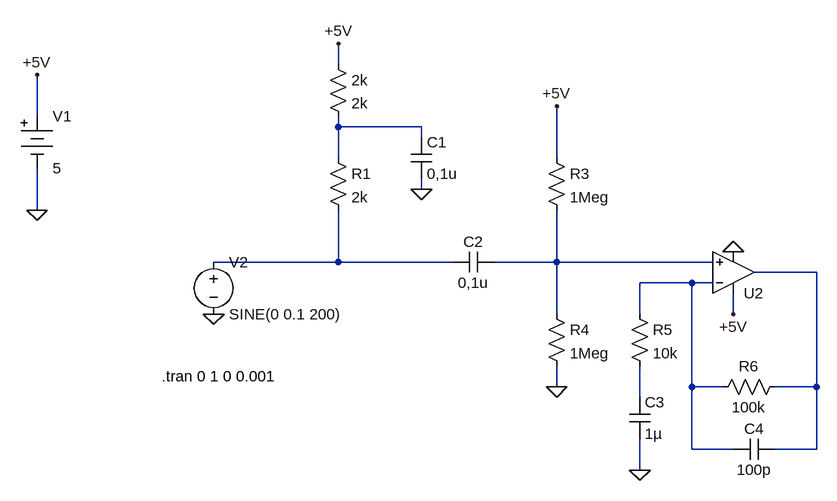
[diagram p0: schematic microphoneAmplifier.asc]
microphoneAmplifier.asc, the LTspice schematic file:
Version 4
SHEET 1 880 680
WIRE 96 -48 96 -80
WIRE -368 32 -368 -32
WIRE 96 48 96 32
WIRE 224 48 96 48
WIRE 224 64 224 48
WIRE 96 96 96 48
WIRE 432 96 432 16
WIRE 224 144 224 128
WIRE -368 176 -368 112
WIRE 96 256 96 176
WIRE 96 256 -96 256
WIRE 272 256 96 256
WIRE 432 256 432 176
WIRE 432 256 336 256
WIRE 672 256 432 256
WIRE 832 272 736 272
WIRE 640 288 560 288
WIRE 672 288 640 288
WIRE 432 336 432 256
WIRE 560 336 560 288
WIRE 704 336 704 304
WIRE 432 448 432 416
WIRE 640 448 640 288
WIRE 688 448 640 448
WIRE 832 448 832 272
WIRE 832 448 768 448
WIRE 560 464 560 416
WIRE 640 544 640 448
WIRE 704 544 640 544
WIRE 832 544 832 448
WIRE 832 544 768 544
WIRE 560 576 560 528
FLAG 560 576 0
FLAG 432 448 0
FLAG -368 -32 +5V
FLAG -368 176 0
FLAG 96 -80 +5V
FLAG 704 240 0
FLAG 704 336 +5V
FLAG 432 16 +5V
FLAG -96 336 0
FLAG 224 144 0
SYMBOL res 80 80 R0
SYMATTR InstName R1
SYMATTR Value 2k
SYMBOL res 80 -64 R0
SYMATTR InstName 2k
SYMATTR Value 2k
SYMBOL cap 336 240 R90
WINDOW 0 0 32 VBottom 2
WINDOW 3 32 32 VTop 2
SYMATTR InstName C2
SYMATTR Value 0,1u
SYMBOL res 416 80 R0
SYMATTR InstName R3
SYMATTR Value 1Meg
SYMBOL res 416 320 R0
SYMATTR InstName R4
SYMATTR Value 1Meg
SYMBOL res 544 320 R0
SYMATTR InstName R5
SYMATTR Value 10k
SYMBOL cap 544 464 R0
SYMATTR InstName C3
SYMATTR Value 1µ
SYMBOL Misc\\battery -368 16 R0
WINDOW 123 0 0 Left 0
WINDOW 39 0 0 Left 0
SYMATTR InstName V1
SYMATTR Value 5
SYMBOL res 784 432 R90
WINDOW 0 0 56 VBottom 2
WINDOW 3 32 56 VTop 2
SYMATTR InstName R6
SYMATTR Value 100k
SYMBOL cap 768 528 R90
WINDOW 0 0 32 VBottom 2
WINDOW 3 32 32 VTop 2
SYMATTR InstName C4
SYMATTR Value 100p
SYMBOL voltage -96 240 R0
WINDOW 123 0 0 Left 0
WINDOW 39 0 0 Left 0
SYMATTR InstName V2
SYMATTR Value SINE(0 0.1 200)
SYMBOL OpAmps\\UniversalOpamp 704 272 M180
SYMATTR InstName U2
SYMBOL cap 208 64 R0
SYMATTR InstName C1
SYMATTR Value 0,1u
TEXT -176 432 Left 2 !.tran 0 1 0 0.001

The netlist it stands for:
* microphoneAmplifier.asc
R1 N001 N002 2k
R§2k +5V N001 2k
C2 N003 N002 0,1u
R3 +5V N003 1Meg
R4 N003 0 1Meg
R5 N005 N006 10k
C3 N006 0 1µ
V1 +5V 0 5
R6 N004 N005 100k
C4 N004 N005 100p
V2 N002 0 SINE(0 0.1 200)
XU2 N003 N005 +5V 0 N004 level1 Avol=1Meg GBW=10Meg Vos=0 En=0 Enk=0 In=0 Ink=0 Rin=500Meg  ; pins In+ In- V+ V- OUT
C1 N001 0 0,1u
.tran 0 1 0 0.001
.lib UniversalOpAmp1.lib
.backanno
.end